# EAGLE design breakout (EAGLE 6.1)
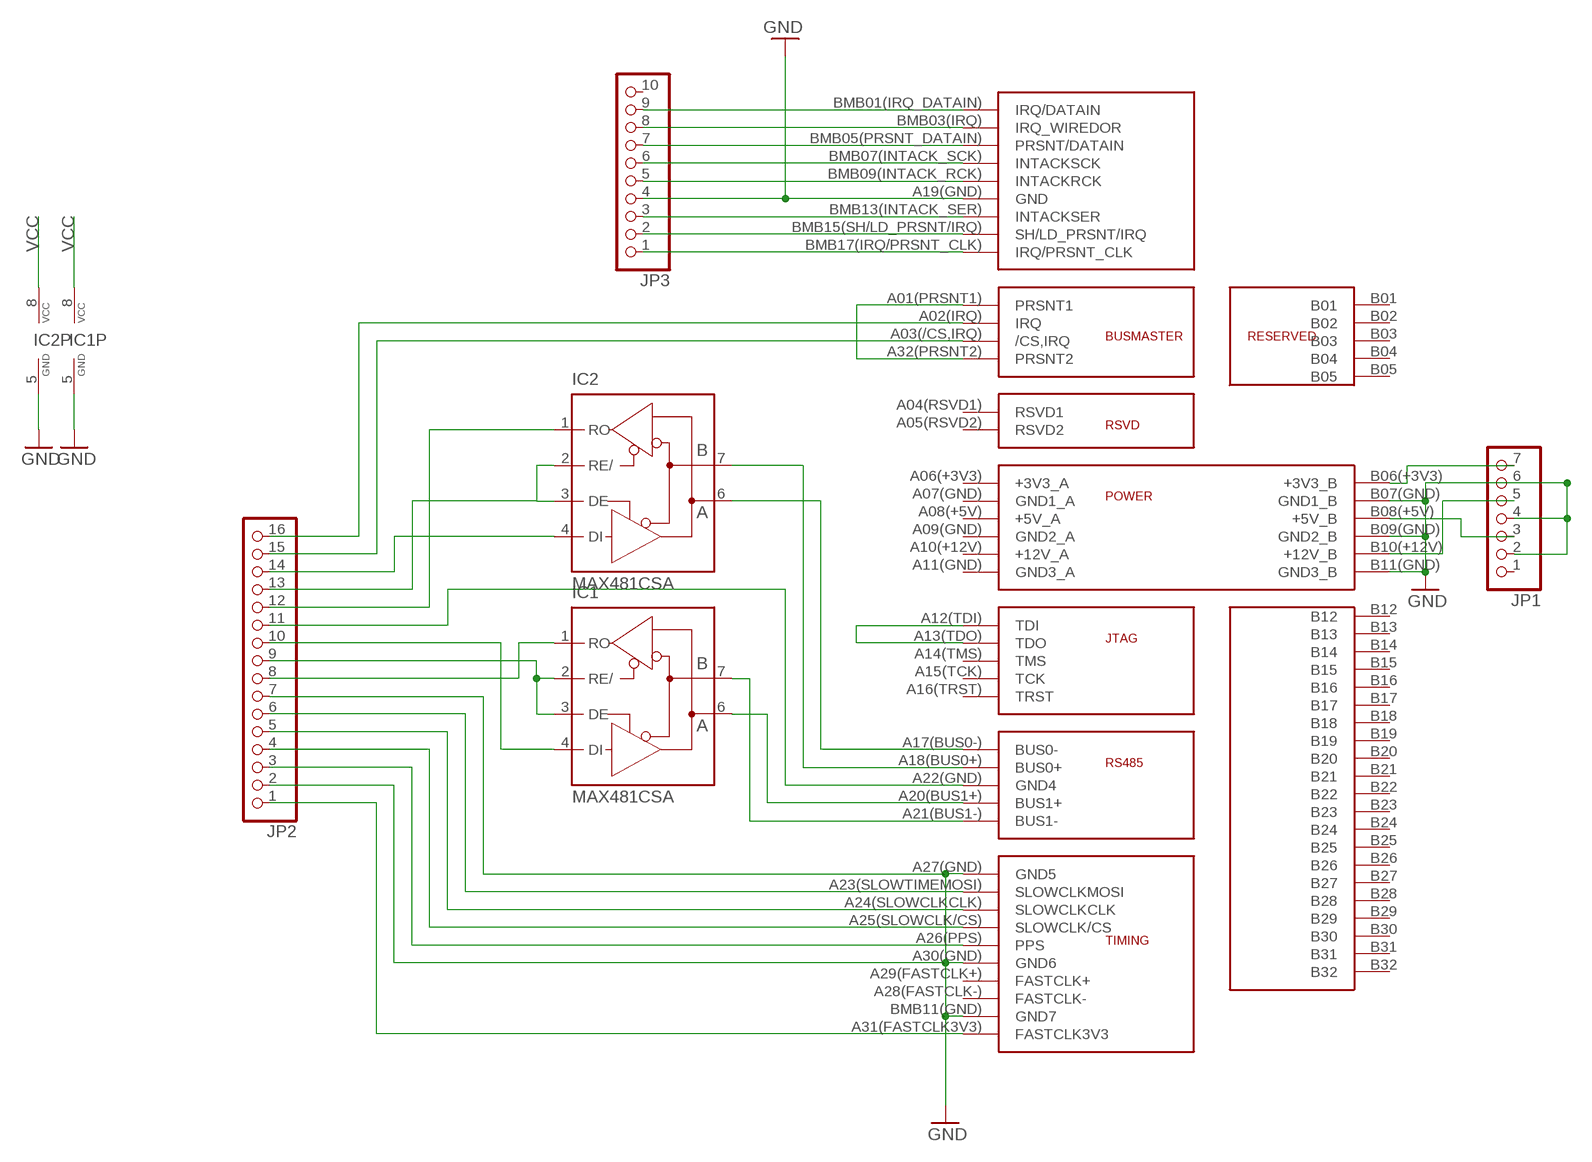
[diagram p0: schematic, sheet 1]

## Parts
IC1  MAX481CSA  [SO08]
IC2  MAX481CSA  [SO08]
JP1  PINHD-1X7  [1X07]
JP2  PINHD-1X16  [1X16]
JP3  PINHD-1X10  [1X10]
U$1  BUSMASTER  [BUSMASTER_EDGE_CONNECTOR]

## Nets
3V3: JP1.7 U$1.B06(+3V3)(+3V3_B)
12V: JP1.5 U$1.B10(+12V)(+12V_B)
GND: IC1.5(GND) IC2.5(GND) JP1.2 JP1.4 JP1.6 JP2.2 JP2.7 JP3.4 U$1.A19(GND)(GND) U$1.A27(GND)(GND5) U$1.A30(GND)(GND6) U$1.B07(GND)(GND1_B) U$1.B09(GND)(GND2_B) U$1.B11(GND)(GND3_B) U$1.BMB11(GND)(GND7)
N$1: U$1.A01(PRSNT1)(PRSNT1) U$1.A32(PRSNT2)(PRSNT2)
N$2: IC2.6(A) U$1.A17(BUS0-)(BUS0-)
N$3: IC2.7(B) U$1.A18(BUS0+)(BUS0+)
N$4: IC2.2(RE/) IC2.3(DE) JP2.13
N$5: JP2.16 U$1.A02(IRQ)(IRQ)
N$6: JP2.15 U$1.A03(/CS,IRQ)(/CS,IRQ)
N$7: IC1.6(A) U$1.A20(BUS1+)(BUS1+)
N$8: IC2.4(DI) JP2.14
N$9: IC1.7(B) U$1.A21(BUS1-)(BUS1-)
N$10: JP2.11 U$1.A22(GND)(GND4)
N$11: IC1.2(RE/) IC1.3(DE) JP2.9
N$12: U$1.A12(TDI)(TDI) U$1.A13(TDO)(TDO)
N$13: JP3.1 U$1.BMB17(IRQ/PRSNT_CLK)(IRQ/PRSNT_CLK)
N$14: IC2.1(RO) JP2.12
N$15: IC1.1(RO) JP2.8
N$16: IC1.4(DI) JP2.10
N$17: JP2.6 U$1.A23(SLOWTIMEMOSI)(SLOWCLKMOSI)
N$18: JP3.2 U$1.BMB15(SH/LD_PRSNT/IRQ)(SH/LD_PRSNT/IRQ)
N$19: JP2.5 U$1.A24(SLOWCLKCLK)(SLOWCLKCLK)
N$20: JP2.4 U$1.A25(SLOWCLK/CS)(SLOWCLK/CS)
N$21: JP2.3 U$1.A26(PPS)(PPS)
N$22: JP3.3 U$1.BMB13(INTACK_SER)(INTACKSER)
N$23: JP2.1 U$1.A31(FASTCLK3V3)(FASTCLK3V3)
N$25: JP3.5 U$1.BMB09(INTACK_RCK)(INTACKRCK)
N$26: JP3.6 U$1.BMB07(INTACK_SCK)(INTACKSCK)
N$27: JP3.7 U$1.BMB05(PRSNT_DATAIN)(PRSNT/DATAIN)
N$28: JP3.8 U$1.BMB03(IRQ)(IRQ_WIREDOR)
N$29: JP3.9 U$1.BMB01(IRQ_DATAIN)(IRQ/DATAIN)
VCC: IC1.8(VCC) IC2.8(VCC) JP1.3 U$1.B08(+5V)(+5V_B)
Unconnected: JP1.1 JP3.10 U$1.A04(RSVD1)(RSVD1) U$1.A05(RSVD2)(RSVD2) U$1.A06(+3V3)(+3V3_A) U$1.A07(GND)(GND1_A) U$1.A08(+5V)(+5V_A) U$1.A09(GND)(GND2_A) U$1.A10(+12V)(+12V_A) U$1.A11(GND)(GND3_A) U$1.A14(TMS)(TMS) U$1.A15(TCK)(TCK) U$1.A16(TRST)(TRST) U$1.A28(FASTCLK-)(FASTCLK-) U$1.A29(FASTCLK+)(FASTCLK+) U$1.B01 U$1.B02 U$1.B03 U$1.B04 U$1.B05 U$1.B12 U$1.B13 U$1.B14 U$1.B15 U$1.B16 U$1.B17 U$1.B18 U$1.B19 U$1.B20 U$1.B21 U$1.B22 U$1.B23 U$1.B24 U$1.B25 U$1.B26 U$1.B27 U$1.B28 U$1.B29 U$1.B30 U$1.B31 U$1.B32

## Library data of the parts
IC1 IC2 = maxim:MAX481CSA: RS485 TRANSEIVER; MF: MAXIM; MPN: MAX481CSA; OC_FARNELL: unknown; OC_NEWARK: 90C3817
JP1 = pinhead:PINHD-1X7: PIN HEADER
JP2 = pinhead:PINHD-1X16: PIN HEADER
JP3 = pinhead:PINHD-1X10: PIN HEADER
U$1 = hgg:BUSMASTER

## Board
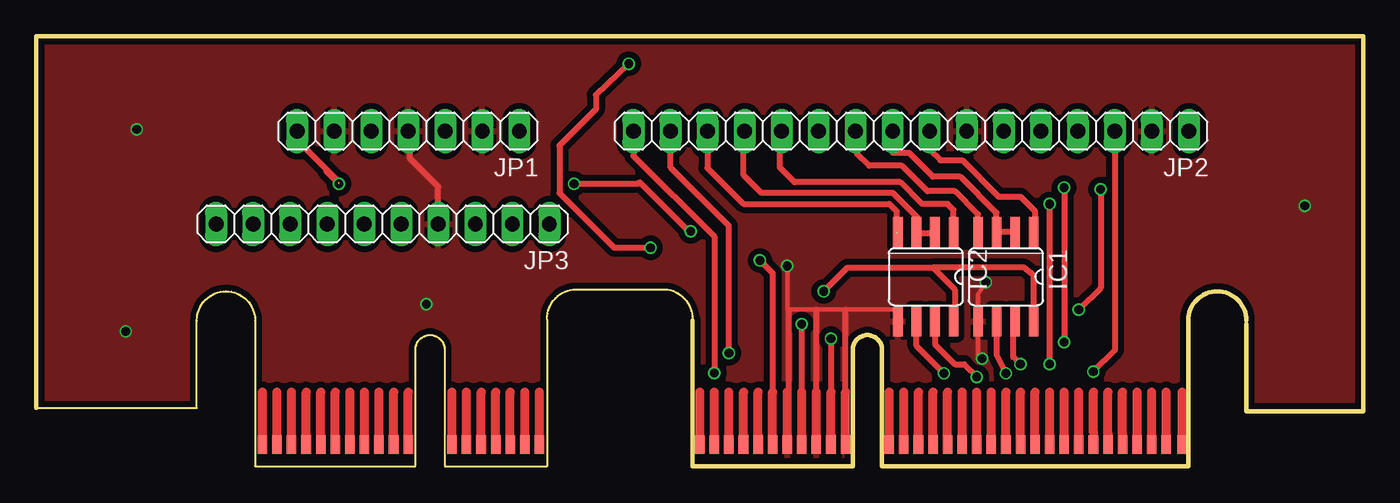
[diagram p1: board, top side]
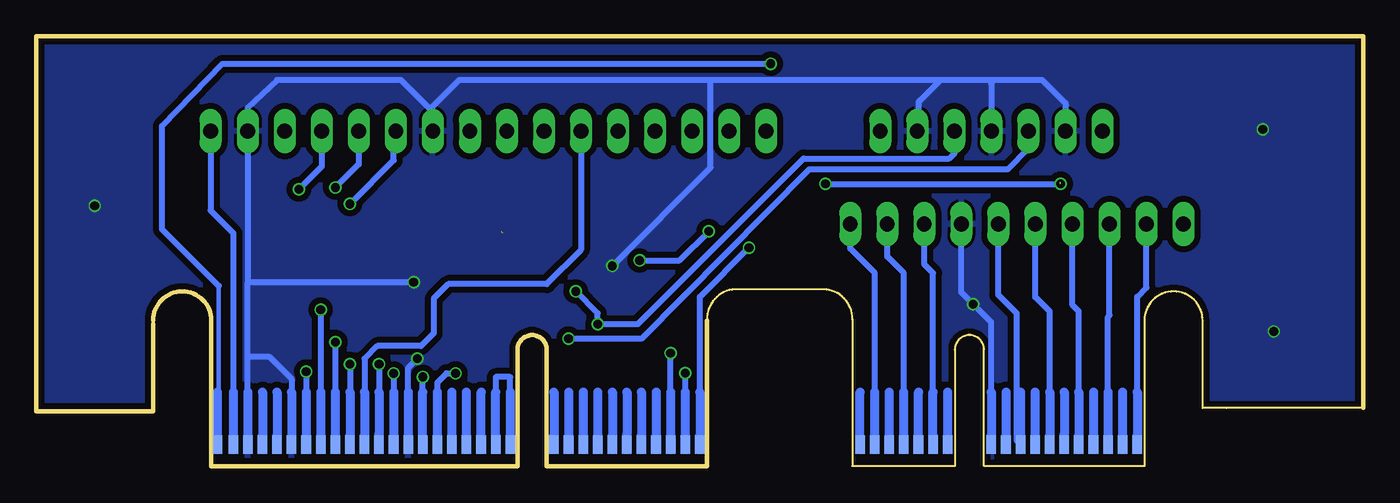
[diagram p2: board, bottom side, seen from below]

Size 91 x 29.5 mm. Coordinates in mm from the lower left corner, seen from the top.
Outline: 45,10 45,0 56,0 56,8 arc-180 58,8 58,0 79,0 79,10 arc-180 83,10
Outline: 83,9.75 83,3.75 91,3.75 91,29.5 0,29.5 0,4
Copper layers (1*16): Top 0.035mm / dielectric 1.5mm / Bottom 0.035mm
Design rules: minimum track width 0.125mm, minimum drill 0.2mm, track to track 0.125mm, track to pad 0.125mm, pad to pad 0.125mm, via to via 0.125mm, smd to smd 0.125mm, copper to edge 0.3mm, drill to drill 0.2mm, minimum pad ring 0.2mm, minimum via ring 0.125mm, stop-mask expansion 0.075mm, vias tented up to drill 0mil, thermal gap 0.2mm

### Footprints (pad centres in the part's own frame; a part is rotated, then mirrored left to right if it is on the bottom)
SO08 = smd 0.66 x 2.032: 1 -1.905,-3.073; 2 -0.635,-3.073; 3 0.635,-3.073; 4 1.905,-3.073; 5 1.905,3.073; 6 0.635,3.073; 7 -0.635,3.073; 8 -1.905,3.073
1X07 = drill 1.016 long: 1 -7.62,0; 2 -5.08,0; 3 -2.54,0; 4 0,0; 5 2.54,0; 6 5.08,0; 7 7.62,0
1X16 = drill 1.016 long: 1 -19.05,0; 2 -16.51,0; 3 -13.97,0; 4 -11.43,0; 5 -8.89,0; 6 -6.35,0; 7 -3.81,0; 8 -1.27,0; 9 1.27,0; 10 3.81,0; 11 6.35,0; 12 8.89,0; 13 11.43,0; 14 13.97,0; 15 16.51,0; 16 19.05,0
1X10 = drill 1.016 long: 1 -11.43,0; 2 -8.89,0; 3 -6.35,0; 4 -3.81,0; 5 -1.27,0; 6 1.27,0; 7 3.81,0; 8 6.35,0; 9 8.89,0; 10 11.43,0
BUSMASTER_EDGE_CONNECTOR = smd 0.66 x 1.27 bottom: A01(PRSNT1) 45.5,-14.5; A02(IRQ) 46.5,-14.5; A03(/CS,IRQ) 47.5,-14.5; A04(RSVD1) 48.5,-14.5; A05(RSVD2) 49.5,-14.5; A06(+3V3) 50.5,-14.5; A07(GND) 51.5,-14.5; A08(+5V) 52.5,-14.5; A09(GND) 53.5,-14.5; A10(+12V) 54.5,-14.5; A11(GND) 55.5,-14.5; A12(TDI) 58.5,-14.5; A13(TDO) 59.5,-14.5; A14(TMS) 60.5,-14.5; A15(TCK) 61.5,-14.5; A16(TRST) 62.5,-14.5; A17(BUS0-) 63.5,-14.5; A18(BUS0+) 64.5,-14.5; A19(GND) 65.5,-14.5; A20(BUS1+) 66.5,-14.5; A21(BUS1-) 67.5,-14.5; A22(GND) 68.5,-14.5; A23(SLOWTIMEMOSI) 69.5,-14.5; A24(SLOWCLKCLK) 70.5,-14.5; A25(SLOWCLK/CS) 71.5,-14.5; A26(PPS) 72.5,-14.5; A27(GND) 73.5,-14.5; A28(FASTCLK-) 74.5,-14.5; A29(FASTCLK+) 75.5,-14.5; A30(GND) 76.5,-14.5; A31(FASTCLK3V3) 77.5,-14.5; A32(PRSNT2) 78.6,-14.5; BMB01(IRQ_DATAIN) 15.5,-14.5; BMB02 16.5,-14.5; BMB03(IRQ) 17.5,-14.5; BMB04 18.5,-14.5; BMB05(PRSNT_DATAIN) 19.5,-14.5; BMB06 20.5,-14.5; BMB07(INTACK_SCK) 21.5,-14.5; BMB08 22.5,-14.5; BMB09(INTACK_RCK) 23.5,-14.5; BMB10 24.5,-14.5; BMB11(GND) 25.5,-14.5; BMB12 28.5,-14.5; BMB13(INTACK_SER) 29.5,-14.5; BMB14 30.5,-14.5; BMB15(SH/LD_PRSNT/IRQ) 31.5,-14.5; BMB16 32.5,-14.5; BMB17(IRQ/PRSNT_CLK) 33.5,-14.5; BMB18 34.5,-14.5 | smd 0.66 x 1.27: B01 45.5,-14.5; B02 46.5,-14.5; B03 47.5,-14.5; B04 48.5,-14.5; B05 49.5,-14.5; B06(+3V3) 50.5,-14.5; B07(GND) 51.5,-14.5; B08(+5V) 52.5,-14.5; B09(GND) 53.5,-14.5; B10(+12V) 54.5,-14.5; B11(GND) 55.5,-14.5; B12 58.5,-14.5; B13 59.5,-14.5; B14 60.5,-14.5; B15 61.5,-14.5; B16 62.5,-14.5; B17 63.5,-14.5; B18 64.5,-14.5; B19 65.5,-14.5; B20 66.5,-14.5; B21 67.5,-14.5; B22 68.5,-14.5; B23 69.5,-14.5; B24 70.5,-14.5; B25 71.5,-14.5; B26 72.5,-14.5; B27 73.5,-14.5; B28 74.5,-14.5; B29 75.5,-14.5; B30 76.5,-14.5; B31 77.5,-14.5; B32 78.6,-14.5; BMA01 15.5,-14.5; BMA02 16.5,-14.5; BMA03 17.5,-14.5; BMA04 18.5,-14.5; BMA05 19.5,-14.5; BMA06 20.5,-14.5; BMA07 21.5,-14.5; BMA08 22.5,-14.5; BMA09 23.5,-14.5; BMA10 24.5,-14.5; BMA11 25.5,-14.5; BMA12 28.5,-14.5; BMA13 29.5,-14.5; BMA14 30.5,-14.5; BMA15 31.5,-14.5; BMA16 32.5,-14.5; BMA17 33.5,-14.5; BMA18 34.5,-14.5

### Placement (x,y rotation side)
IC1  66.5,13 180 top
IC2  61,13 180 top
JP1  25.5,23 180 top
JP2  60,23 180 top
JP3  23.75,16.62 180 top
U$1  0,16 0 top

### Tracks (layer width: path | path; a pad name or v marks a point on that pad's centre or on a via)
3V3  (via drill 0.6)  (1 unrouted)
  Top 0.406: v49.62,14.12 50.5,13.25 U$1.B06(+3V3) | v44.88,16.12 44.75,16.12 41.38,19.5 41.25,19.38 v36.88,19.38 | 20.75,19.5 17.88,22.38 JP1.7 | v20.75,19.38 19.88,20.25
  Bottom 0.406: v49.62,14.12 46.88,14.12 v44.88,16.12 | v36.88,19.38 v20.75,19.38
12V  (via drill 0.6)
  Top 0.406: v54.5,8.75 U$1.B10(+12V)
  Bottom 0.406: JP1.5 22.96,21.79 24.38,20.38 38,20.38 49.5,8.75 v54.5,8.75
GND  (via drill 0.6)
  Top 0.305: v65.12,12.62 64.59,11.78 IC1.5 64.59,7.66 v64.88,7.38 | IC2.5 59.09,10.6 59.25,10.75 55.5,10.75 53.5,10.75 51.62,10.75 51.5,10.75 v51.5,13.75
  Top 0.406: U$1.B11(GND) 55.5,10.75 | U$1.B07(GND) 51.62,1.5 51.62,10.75 | U$1.B09(GND) 53.5,10.75 | JP3.4 27.56,19.19 25.62,21.12 25.62,22.88 JP1.4
  Bottom 0.305: 76.5,24.62 JP2.2 | 25.5,26.25 25.25,26.5 | 20.42,24.92 JP1.6
  Bottom 0.406: 20.42,24.92 22,26.5 25.25,26.5 29,26.5 | 29,26.5 44.75,26.5 | 44.75,26.5 62,26.5 64,24.5 | JP2.7 64,23.19 64,24.5 | 64,24.5 66,26.5 74.5,26.5 76.5,24.62 | v65.12,12.62 76.5,12.62 | 76.5,7.5 76.5,12.62 | 76.5,7.5 75,7.5 73.5,6 U$1.A27(GND) | 29,26.5 30.5,25 30.5,23.08 JP1.2 | 44.75,26.5 44.75,20.5 v51.5,13.75 | 25.5,26.25 JP1.4 | U$1.A19(GND) 65.5,6.75 v64.88,7.38 | U$1.A30(GND) 76.5,7.5 | U$1.BMB11(GND) 25.5,9.88 v26.75,11.12 27.56,11.94 JP3.4 | JP1.6 20.38,23.05 20.38,24.75 | JP2.2 76.5,12.62
  other vias: 6.88,23.12 87,17.88 6.12,9.25
  pour Bottom (isolate 0.406): -0.88,39.25 91.75,39.25 92.38,-9.88 -1.62,-9.88 -1.12,31.25
  pour Top (isolate 0.406): -7.75,30.38 96.25,30.62 96.12,-4.12 -7.62,-4.12 -7.62,27.12
N$1  (via drill 0.6)
  Top 0.406: v42.12,15 39.62,15 35.88,18.75 35.88,22 38.38,24.5 38.38,25.5 v40.62,27.62
  Bottom 0.305: U$1.A32(PRSNT2) 78.5,1.6 78.5,12.38
  Bottom 0.406: U$1.A01(PRSNT1) 45.5,11.62 v42.12,15 | 78.5,12.38 82.38,16.25 82.38,23.38 78.25,27.62 v40.62,27.62
N$2  (via drill 0.6)
  Top 0.406: v62.25,6.38 60.37,8.26 IC2.6
  Bottom 0.406: U$1.A17(BUS0-) 63.5,5.75 62.88,6.38 v62.25,6.38
N$3  (via drill 0.6)
  Top 0.406: IC2.7 61.63,8.37 63,7 63.62,7 v64.5,6.12
  Bottom 0.406: U$1.A18(BUS0+) v64.5,6.12
N$4
  Top 0.305: 61.56,16 IC2.2 | 48.5,22.93 JP2.13
  Top 0.406: 60.5,16 60.5,17 58.75,18.75 49.75,18.75 48.5,20 48.5,22.93 | 60.5,16 60.44,16 IC2.3 | 60.5,16 61.56,16
N$5  (via drill 0.6)
  Top 0.406: JP2.16 40.95,21.3 46.5,15.75 v46.5,6.38
  Bottom 0.406: v46.5,6.38 U$1.A02(IRQ)
N$6  (via drill 0.6)
  Top 0.305: JP2.15
  Top 0.406: v47.5,7.76 47.5,16.5 43.5,20.5 JP2.15
  Bottom 0.406: U$1.A03(/CS,IRQ) v47.5,7.76
N$7  (via drill 0.6)
  Top 0.406: IC1.6 65.86,7.63 v66.5,6.38
  Bottom 0.406: v66.5,6.38 U$1.A20(BUS1+)
N$8  (1 unrouted)
  Top 0.406: JP2.14 46.03,20.47 48.5,18 58.5,18 59,17.5 59,16
N$9  (via drill 0.6)
  Top 0.406: v67.5,7 67,7.5 67,9.79 IC1.7
  Bottom 0.406: v67.5,7 U$1.A21(BUS1-)
N$10
  Bottom 0.406: JP2.11 53.65,14.85 56,12.5 62.75,12.5 63.75,11.5 63.75,9.12 64.62,8.25 67.62,8.25 68.5,7.38 U$1.A22(GND)
N$11
  Top 0.406: IC1.2 IC1.3 65.86,17.39 63.38,19.88 61.48,19.88 59.88,21.5 58.75,21.5 JP2.9
N$12
  Bottom 0.406: U$1.A12(TDI) 58.5,6.12 59.5,6.12 U$1.A13(TDO)
N$13
  Bottom 0.406: U$1.BMB17(IRQ/PRSNT_CLK) 33.5,13.25 35.18,14.93 JP3.1
N$14
  Top 0.406: IC2.1 62.91,17.59 62.5,18 60.75,18 59.25,19.5 52,19.5 51,20.5 51,22.89 JP2.12
N$15
  Top 0.406: JP2.8 61.27,21.73 62,21 63.5,21 66,18.5 67.5,18.5 68.5,17.5 68.5,16.17 IC1.1
N$16
  Top 0.406: IC1.4 64.59,17.28 63,18.88 61.12,18.88 59.38,20.62 57.12,20.62 56.25,21.5 JP2.10
N$17  (via drill 0.6)
  Top 0.406: v69.5,7.01 v69.5,18
  Bottom 0.406: v69.5,18 66.5,21 66.5,22.85 JP2.6 | v69.5,7.01 U$1.A23(SLOWTIMEMOSI)
N$18
  Bottom 0.406: U$1.BMB15(SH/LD_PRSNT/IRQ) 31.5,13.25 32.64,14.39 JP3.2
N$19  (via drill 0.6)
  Top 0.406: v70.5,19.12 v70.5,8.51
  Bottom 0.406: JP2.5 68.89,20.73 v70.5,19.12 | v70.5,8.51 U$1.A24(SLOWCLKCLK)
N$20  (via drill 0.6)
  Top 0.406: v73,19 73,12.25 v71.5,10.75
  Bottom 0.406: JP2.4 71.43,20.57 v73,19 | v71.5,10.75 U$1.A25(SLOWCLK/CS)
N$21  (via drill 0.6)
  Top 0.305: 74,23 JP2.3
  Top 0.406: v72.5,6.5 74,8 74,23
  Bottom 0.406: v72.5,6.5 U$1.A26(PPS)
N$22
  Bottom 0.406: U$1.BMB13(INTACK_SER) 29.5,13.25 30.1,13.85 JP3.3
N$23
  Bottom 0.406: JP2.1 79.05,17.55 77.5,16 U$1.A31(FASTCLK3V3)
N$25
  Bottom 0.406: U$1.BMB09(INTACK_RCK) 23.75,1.75 23.75,10.5 25.02,11.77 JP3.5
N$26
  Bottom 0.406: U$1.BMB07(INTACK_SCK) 21.5,10.62 22.48,11.61 JP3.6
N$27
  Bottom 0.406: U$1.BMB05(PRSNT_DATAIN) 19.5,10.62 19.94,11.06 JP3.7
N$28
  Bottom 0.406: U$1.BMB03(IRQ) 17.5,10.25 17.4,10.35 JP3.8
N$29
  Bottom 0.406: U$1.BMB01(IRQ_DATAIN) 15.5,11.62 14.86,12.27 JP3.9
VCC  (via drill 0.6)  (1 unrouted)
  Top 0.406: U$1.B08(+5V) v52.5,9.75 | v54,12 55.62,13.62 61.5,13.62 | 61.5,13.62 63,12.12 63,10.02 IC2.8 | IC1.8 68.41,13.1 67.75,13.62 61.5,13.62
  Bottom 0.305: 28,22.71 JP1.3
  Bottom 0.406: 28,22.71 28,21.5 28.38,21.12 38.38,21.12 49.75,9.75 v52.5,9.75 52.5,10.5 v54,12